# EAGLE design IRcamera (EAGLE 9.5.2)
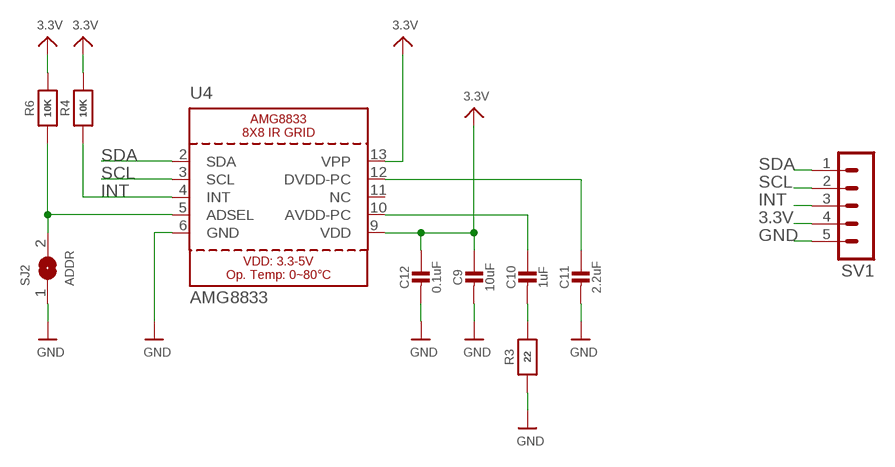
[diagram p0: schematic, sheet 1]

## Parts
C9  10uF  CAP_CERAMIC0805-NOOUTLINE  [0805-NO]
C10  1uF  CAP_CERAMIC0805-NOOUTLINE  [0805-NO]
C11  2.2uF  CAP_CERAMIC0805-NOOUTLINE  [0805-NO]
C12  0.1uF  CAP_CERAMIC0805-NOOUTLINE  [0805-NO]
R3  22  RESISTOR0805_NOOUTLINE  [0805-NO]
R4  10K  RESISTOR0805_NOOUTLINE  [0805-NO]
R6  10K  RESISTOR0805_NOOUTLINE  [0805-NO]
SJ2  ADDR  SOLDERJUMPER  [SOLDERJUMPER_ARROW_NOPASTE]
SV1  MA05-1  [MA05-1]
U4  AMG8833  [AMG8833]

## Nets
3.3V: C9.1 C12.1 R4.2 R6.2 SV1.4 U4.9(VDD) U4.13(VPP)
AVDD-PC1: C10.1 U4.10(AVDD-PC)
DVDD-PC1: C11.1 U4.12(DVDD-PC)
GND: C9.2 C11.2 C12.2 R3.1 SJ2.1 SV1.5 U4.6(GND)
INT: R4.1 SV1.3 U4.4(INT)
N$6: R6.1 SJ2.2 U4.5(ADSEL)
N$7: C10.2 R3.2
SCL: SV1.2 U4.3(SCL)
SDA: SV1.1 U4.2(SDA)
Unconnected: U4.11(NC)

## Library data of the parts
C9-C12 = microbuilder:CAP_CERAMIC: Ceramic Capacitors For new designs, use the packages preceded by an '_' character since they are more reliable: The following footprints should be used on most boards: _0402 - Standard footprint for regular board layouts _0603 - Standard footprint for regular board layouts _0805 - Standard footprint for regular board layouts _1206 - Standard footprint for regular board layouts For extremely tight-pitch boards where space is at a premium, the following 'micro-pitch' footprints can be used (smaller pads, no silkscreen outline, etc.): _0402MP - Micro-pitch footprint for very dense/compact boards _0603MP - Micro-pitch footprint for very dense/compact boards _0805MP - Micro-pitch footprint for very dense/compact boards _1206MP - Micro-pitch footprint for very dense/compact boards
R3 R4 R6 = microbuilder:RESISTOR: Resistors For new designs, use the packages preceded by an '_' character since they are more reliable: The following footprints should be used on most boards: _0402 - Standard footprint for regular board layouts _0603 - Standard footprint for regular board layouts _0805 - Standard footprint for regular board layouts _1206 - Standard footprint for regular board layouts For extremely tight-pitch boards where space is at a premium, the following 'micro-pitch' footprints can be used (smaller pads, no silkscreen outline, etc.): _0402MP - Micro-pitch footprint for very dense/compact boards _0603MP - Micro-pitch footprint for very dense/compact boards _0805MP - Micro-pitch footprint for very dense/compact boards _1206MP - Micro-pitch footprint for very dense/compact boards
SJ2 = microbuilder:SOLDERJUMPER: SMD Solder JUMPER Solder the two pads together to create a connection, or remove the solder to break it. REFLOW - Use this footprint for solder paste and reflow ovens. WAVE - Use this footprint for hand-soldering (larger pads). CLOSED - Has a trace between the two pads to ensure it is closed by default. The trace needs to be cut to disable the jumper, and can be closed again by creating a solder bridge between the two pads.; BOM: EXCLUDE
SV1 = con-lstb:MA05-1: PIN HEADER; OC_FARNELL: unknown; OC_NEWARK: unknown
U4 = microbuilder:AMG8833: AMG8833 8x8 IR Grid Sensor Viewing Angle: ~60° Temp Accuracy: +/-2-3°C (high/low gain)

## Board
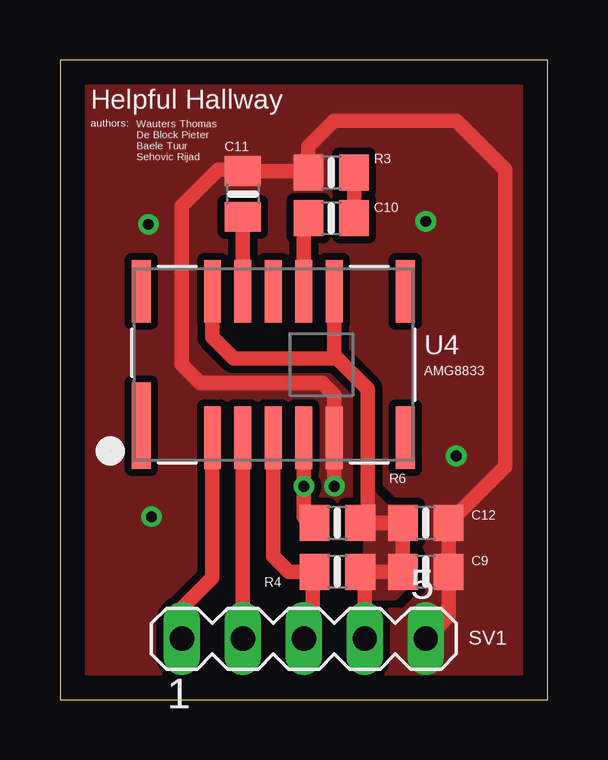
[diagram p1: board, top side]
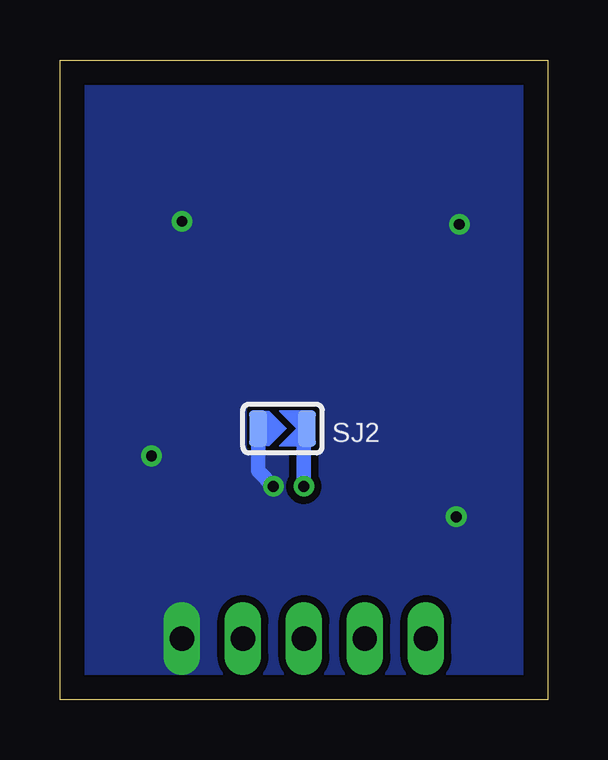
[diagram p2: board, bottom side, seen from below]

Size 20.32 x 26.67 mm. Coordinates in mm from the lower left corner, seen from the top.
Outline: 0,0 20.32,0 20.32,26.67 0,26.66 0,0
Copper layers (1*16): Top 0.035mm / dielectric 1.5mm / Bottom 0.035mm
Design rules "default": minimum track width 6mil, minimum drill 0.35mm, track to track 6mil, track to pad 6mil, pad to pad 6mil, via to via 6mil, smd to smd 6mil, copper to edge 40mil, drill to drill 6mil, minimum pad ring 10mil, minimum via ring 8mil, stop-mask expansion 4mil, vias tented up to drill 0mil, thermal gap 10mil

### Footprints (pad centres in the part's own frame; a part is rotated, then mirrored left to right if it is on the bottom)
0805-NO = smd 1.24 x 1.5: 1 -0.95,0; 2 0.95,0
SOLDERJUMPER_ARROW_NOPASTE = smd 0.762 x 1.524: 1 -1.016,0; 2 1.016,0
MA05-1 = drill 1.016 long: 1 -5.08,0; 2 -2.54,0; 3 0,0; 4 2.54,0; 5 5.08,0
AMG8833 = smd 0.8 x 3.6: 1 -5.5,-2.55 | smd 0.7 x 2.6: 2 -2.54,-3.05; 3 -1.27,-3.05; 4 0,-3.05; 5 1.27,-3.05; 6 2.54,-3.05; 9 2.54,3.05; 10 1.27,3.05; 11 0,3.05; 12 -1.27,3.05; 13 -2.54,3.05 | smd 0.8 x 2.6: 7 5.5,-3.05; 8 5.5,3.05; 14 -5.5,3.05

### Placement (x,y rotation side)
C9  15.24,5.33 0 top
C10  11.3,20.07 0 top
C11  7.62,21.08 90 top
C12  15.24,7.37 0 top
R3  11.3,21.97 0 top
R4  11.56,5.33 0 top
R6  11.56,7.37 0 top
SJ2  11.05,11.3 0 bottom
SV1  10.16,2.54 0 top
U4  8.89,13.97 0 top

### Tracks (layer width: path | path; a pad name or v marks a point on that pad's centre or on a via)
3.3V
  Top 0.61: U4.13 6.35,15.11 7.24,14.22 11.56,14.22 | 11.56,14.22 12.83,12.95 12.83,7.69 R6.2 C12.1 C9.1 R4.2 12.7,5.14 SV1.4 | 11.56,14.22 11.43,14.35 U4.9
  pour Top (isolate 0.254, no thermals): 12.7,4.19 13.97,4.19 14.48,4.7 14.48,7.24 13.08,8.64 12.7,8.64
AVDD-PC1
  Top 0.61: U4.10 10.16,19.87 C10.1
DVDD-PC1
  Top 0.61: C11.1 U4.12
GND  (via drill 0.45)
  Top 0.61: SV1.5 16.19,3.49 C9.2 C12.2 18.54,9.72 18.54,22.1 16.51,24.13 11.43,24.13 10.35,23.05 R3.1 10.29,22.03 C11.2 7.55,22.1 6.6,22.1 5.08,20.57 5.08,13.97 5.84,13.21 10.92,13.21 11.43,12.7 U4.6 v11.43,8.89
  Bottom 0.61: SJ2.1 12.06,9.53 v11.43,8.89
  other vias: 3.68,19.81 15.24,19.94 3.81,7.62 16.51,10.16
  pour Bottom (isolate 0.305, no thermals): 0,26.67 20.32,26.67 20.32,0 0,0
  pour Top (isolate 0.305, rank 2, no thermals): 0,0 0,26.67 20.32,26.67 20.32,0
INT
  Top 0.61: U4.4 8.89,5.97 9.53,5.33 R4.1 10.54,5.27 10.54,2.92 SV1.3
N$6  (via drill 0.45)
  Top 0.61: R6.1 10.67,7.43 10.35,7.43 10.16,7.62 v10.16,8.89 U4.5
  Bottom 0.61: v10.16,8.89 10.16,11.18 SJ2.2
N$7
  Top 0.61: C10.2 R3.2
SCL
  Top 0.61: SV1.2 U4.3
SDA
  Top 0.61: SV1.1 5.08,3.81 6.35,5.08 U4.2

### Text on the board
tPlace: Helpful Hallway | authors: | Wauters Thomas / De Block Pieter / Baele Tuur / Sehovic Rijad